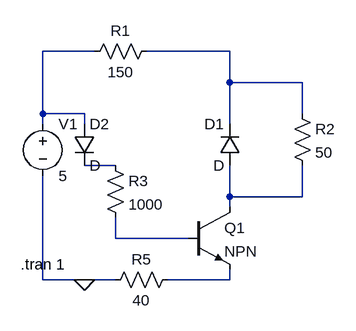
[diagram p0: schematic MotorControlCircuit.asc]
MotorControlCircuit.asc, the LTspice schematic file:
Version 4
SHEET 1 880 680
WIRE 80 32 0 32
WIRE 288 32 160 32
WIRE 288 80 288 32
WIRE 400 80 288 80
WIRE 0 128 0 32
WIRE 64 128 0 128
WIRE 400 128 400 80
WIRE 0 144 0 128
WIRE 64 144 64 128
WIRE 288 144 288 80
WIRE 112 208 64 208
WIRE 288 256 288 208
WIRE 400 256 400 208
WIRE 400 256 288 256
WIRE 288 272 288 256
WIRE 112 320 112 288
WIRE 224 320 112 320
WIRE 0 384 0 224
WIRE 64 384 0 384
WIRE 112 384 64 384
WIRE 288 384 288 368
WIRE 288 384 192 384
FLAG 64 384 0
SYMBOL voltage 0 128 R0
WINDOW 123 0 0 Left 2
WINDOW 39 0 0 Left 2
SYMATTR InstName V1
SYMATTR Value 5
SYMBOL npn 224 272 R0
SYMATTR InstName Q1
SYMBOL diode 304 208 R180
WINDOW 0 24 64 Left 2
WINDOW 3 24 0 Left 2
SYMATTR InstName D1
SYMBOL res 176 16 R90
WINDOW 0 0 56 VBottom 2
WINDOW 3 32 56 VTop 2
SYMATTR InstName R1
SYMATTR Value 150
SYMBOL res 384 112 R0
SYMATTR InstName R2
SYMATTR Value 50
SYMBOL res 208 368 R90
WINDOW 0 0 56 VBottom 2
WINDOW 3 32 56 VTop 2
SYMATTR InstName R5
SYMATTR Value 40
SYMBOL diode 48 144 R0
SYMATTR InstName D2
SYMBOL res 96 192 R0
SYMATTR InstName R3
SYMATTR Value 1000
TEXT -34 360 Left 2 !.tran 1

The netlist it stands for:
* MotorControlCircuit.asc
V1 N001 0 5
Q1 N004 N005 N006 0 NPN
D1 N004 N002 D
R1 N002 N001 150
R2 N002 N004 50
R5 N006 0 40
D2 N001 N003 D
R3 N003 N005 1000
.model D D
.lib standard.dio
.model NPN NPN
.model PNP PNP
.lib standard.bjt
.tran 1
.backanno
.end